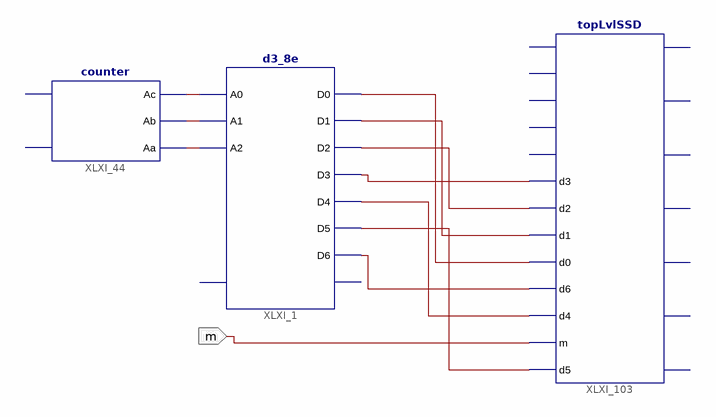
[diagram p0: schematic sheet 1]
// Xilinx ISE schematic Decoder2.sch (xc9500xl) as structural Verilog: 3 symbols, 1 ports
module Decoder2 (
  input  m
);

  wire XLXN_1, XLXN_2, XLXN_3, XLXN_132, XLXN_133, XLXN_134, XLXN_135, XLXN_136, XLXN_137, XLXN_138;

  d3_8e XLXI_1 (
    .A0(XLXN_1), .A1(XLXN_2), .A2(XLXN_3), .D0(XLXN_132), .D1(XLXN_133), .D2(XLXN_134), .D3(XLXN_135),
    .D4(XLXN_136), .D5(XLXN_138), .D6(XLXN_137));  // open: E, D7
  counter XLXI_44 (.Ac(XLXN_1), .Ab(XLXN_2), .Aa(XLXN_3));  // open: Clk, Res
  topLvlSSD XLXI_103 (
    .d3(XLXN_135), .d2(XLXN_134), .d1(XLXN_133), .d0(XLXN_132), .d6(XLXN_137), .d4(XLXN_136), .m(m),
    .d5(XLXN_138));  // open: B4, B3, B2, B1, B0, a, d, e, f, b, c, g
endmodule
